# Altium schematic sheet Top Level.SchDoc
size A4
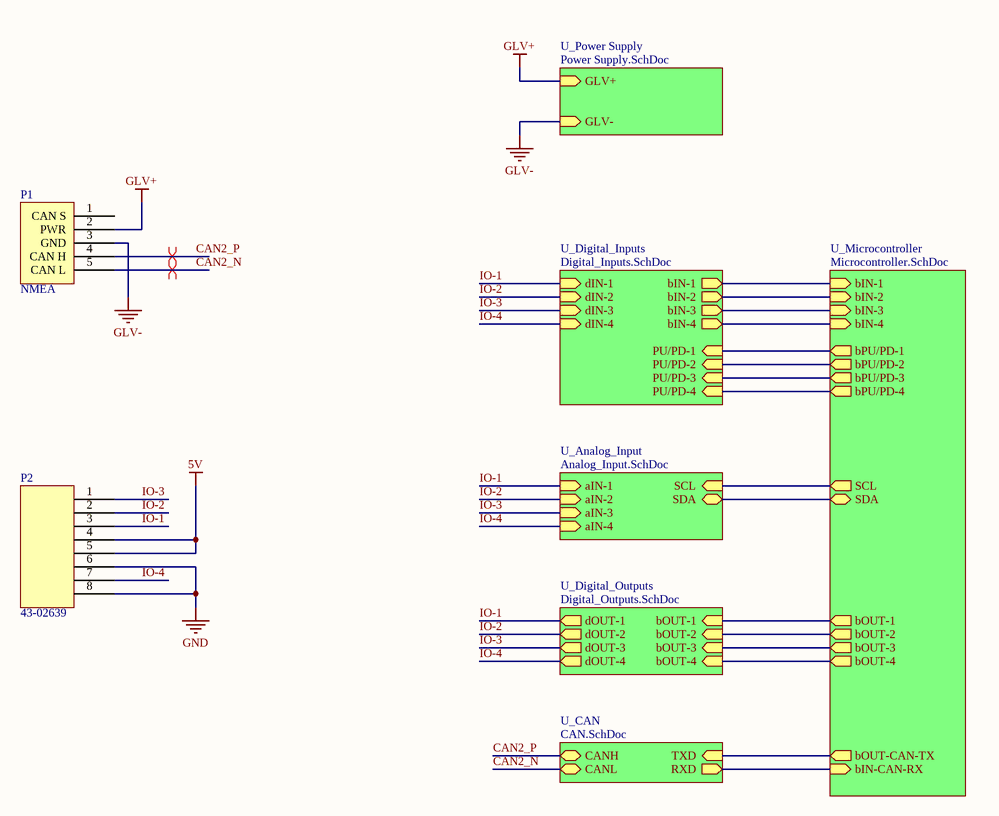
[diagram p0: Top Level.SchDoc]

## Parts
P1  NMEA  [43-01203]
P2  43-02639  [43-02639]

## Sub-sheets
U_Analog_Input = Analog_Input.SchDoc: SCL (in), SDA (bidir), aIN-1 (in), aIN-2 (in), aIN-3 (in), aIN-4 (in)
U_CAN = CAN.SchDoc: TXD (in), RXD (out), CANH (bidir), CANL (bidir)
U_Digital_Inputs = Digital_Inputs.SchDoc: dIN-1 (in), dIN-2 (in), dIN-3 (in), dIN-4 (in), bIN-4 (out), bIN-2 (out), bIN-1 (out), bIN-3 (out), PU/PD-1 (in), PU/PD-2 (in), PU/PD-3 (in), PU/PD-4 (in)
U_Digital_Outputs = Digital_Outputs.SchDoc: bOUT-1 (in), bOUT-2 (in), bOUT-3 (in), bOUT-4 (in), dOUT-1 (out), dOUT-2 (out), dOUT-3 (out), dOUT-4 (out)
U_Microcontroller = Microcontroller.SchDoc: bOUT-CAN-TX (out), bIN-CAN-RX (in), SCL (out), SDA (bidir), bOUT-1 (out), bOUT-2 (out), bOUT-3 (out), bOUT-4 (out), bIN-1 (in), bIN-2 (in), bIN-3 (in), bIN-4 (in), bPU/PD-1 (out), bPU/PD-2 (out), bPU/PD-3 (out), bPU/PD-4 (out)
U_Power Supply = Power Supply.SchDoc: GLV+ (in), GLV- (in)

## Nets
5V: P2.4 P2.5
GLV+: P1.2(PWR) ; sheet U_Power Supply/GLV+
GLV-: P1.3(GND) ; sheet U_Power Supply/GLV-
GND: P2.6 P2.8
CAN2_N: P1.5(CAN_L) ; sheet U_CAN/CANL
CAN2_P: P1.4(CAN_H) ; sheet U_CAN/CANH
IO-1: P2.3 ; sheet U_Analog_Input/aIN-1, sheet U_Digital_Outputs/dOUT-1, sheet U_Digital_Inputs/dIN-1
IO-2: P2.2 ; sheet U_Analog_Input/aIN-2, sheet U_Digital_Outputs/dOUT-2, sheet U_Digital_Inputs/dIN-2
IO-3: P2.1 ; sheet U_Analog_Input/aIN-3, sheet U_Digital_Outputs/dOUT-3, sheet U_Digital_Inputs/dIN-3
IO-4: P2.7 ; sheet U_Analog_Input/aIN-4, sheet U_Digital_Outputs/dOUT-4, sheet U_Digital_Inputs/dIN-4
(unnamed): sheet U_Analog_Input/SCL, sheet U_Microcontroller/SCL
(unnamed): sheet U_Analog_Input/SDA, sheet U_Microcontroller/SDA
(unnamed): sheet U_Digital_Outputs/bOUT-1, sheet U_Microcontroller/bOUT-1
(unnamed): sheet U_Digital_Outputs/bOUT-2, sheet U_Microcontroller/bOUT-2
(unnamed): sheet U_Digital_Outputs/bOUT-3, sheet U_Microcontroller/bOUT-3
(unnamed): sheet U_Digital_Outputs/bOUT-4, sheet U_Microcontroller/bOUT-4
(unnamed): sheet U_CAN/TXD, sheet U_Microcontroller/bOUT-CAN-TX
(unnamed): sheet U_CAN/RXD, sheet U_Microcontroller/bIN-CAN-RX
(unnamed): sheet U_Microcontroller/bIN-1, sheet U_Digital_Inputs/bIN-1
(unnamed): sheet U_Microcontroller/bIN-2, sheet U_Digital_Inputs/bIN-2
(unnamed): sheet U_Microcontroller/bIN-3, sheet U_Digital_Inputs/bIN-3
(unnamed): sheet U_Microcontroller/bIN-4, sheet U_Digital_Inputs/bIN-4
(unnamed): sheet U_Microcontroller/bPU/PD-1, sheet U_Digital_Inputs/PU/PD-1
(unnamed): sheet U_Microcontroller/bPU/PD-2, sheet U_Digital_Inputs/PU/PD-2
(unnamed): sheet U_Microcontroller/bPU/PD-3, sheet U_Digital_Inputs/PU/PD-3
(unnamed): sheet U_Microcontroller/bPU/PD-4, sheet U_Digital_Inputs/PU/PD-4

Not connected (* = marked no-connect by the designer): P1 1(CAN_S)

## Layout directives
differential pair: CAN2_N, CAN2_P

## Library data of the parts
P1 = 43-01203: M12 NMEA 2000 Header; Positions: 5; Angle: 90; Flange: Yes; Contact: Gold; Part Number: 43-01203; Digikey Part Number: 626-1511-ND
P2 = 43-02639: M12, 8 Pin Connector; Positions: 8; Angle: 90; Flange: Yes; Contact: Copper Alloy; Part Number: 43-02639